# Altium schematic sheet 6.SchDoc
size A4; SheetNumber: 5; SheetTotal: 5
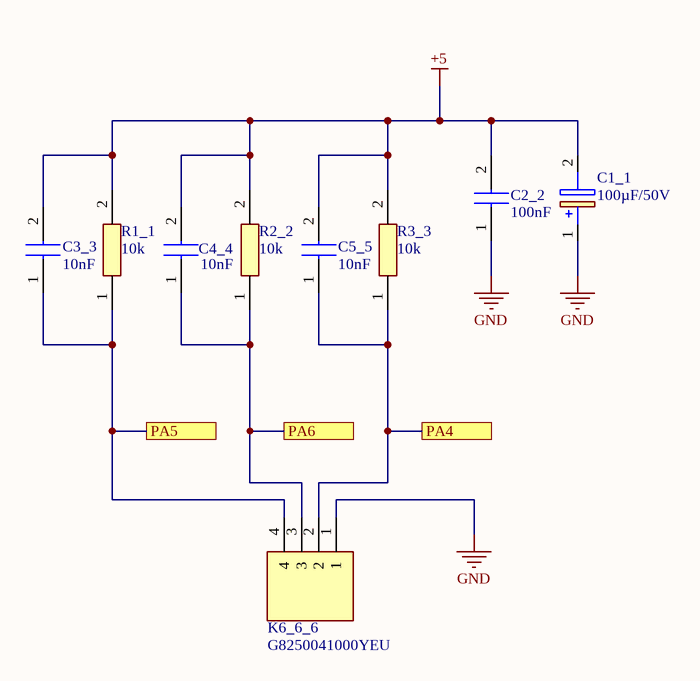
[diagram p0: 6.SchDoc]

## Parts
C1_1  100µF/50V  [CAPPRD350W60D800H1250]
C2_2  100nF  [0805]
C3_3  10nF  [0805]
C4_4  10nF  [0805]
C5_5  10nF  [0805]
K6_6_6  G8250041000YEU  [G8250041000YEU]
R1_1  10k  [0805]
R2_2  10k  [0805]
R3_3  10k  [0805]

## Ports
PA4, PA5, PA6

## Nets
+5: C1_1.2(-) C2_2.2 C3_3.2 C4_4.2 C5_5.2 R1_1.2 R2_2.2 R3_3.2
GND: C1_1.1(+) C2_2.1 K6_6_6.1
PA4: C5_5.1 K6_6_6.2 R3_3.1 ; port PA4
PA5: C3_3.1 K6_6_6.4 R1_1.1 ; port PA5
PA6: C4_4.1 K6_6_6.3 R2_2.1 ; port PA6

## Library data of the parts
C1_1 = ESK107M050AG3EA: Capacitor Polarised; Manufacturer_Name: Kemet; Height: 12.5mm; Manufacturer_Part_Number: ESK107M050AG3EA
C2_2 C3_3 C4_4 C5_5 = C0805C301G5GACTU: Capacitor; Manufacturer_Name: Kemet; Datasheet Link: https://connect.kemet.com:7667/gateway/IntelliData-ComponentDocumentation/1.0/download/specsheet/C0805C301G5GACTU; Height: 0.88mm; Manufacturer_Part_Number: C0805C301G5GACTU
K6_6_6 = G8250041000YEU: Connector; Manufacturer_Name: Amphenol; Datasheet Link: https://cdn.amphenol-icc.com/media/wysiwyg/files/drawing/g825xxx10x0yeu.pdf; Height: 6.35mm; Manufacturer_Part_Number: G8250041000YEU
R1_1 R2_2 R3_3 = CFN0805-FZ-R030ELF: Resistor; Manufacturer_Name: Bourns; Datasheet Link: https://www.bourns.com/docs/Product-Datasheets/CFN.pdf; Height: 0.9mm; Manufacturer_Part_Number: CFN0805-FZ-R030ELF